# Altium schematic sheet Std 5V.SchDoc
size A4; SheetNumber: 1; SheetTotal: 6
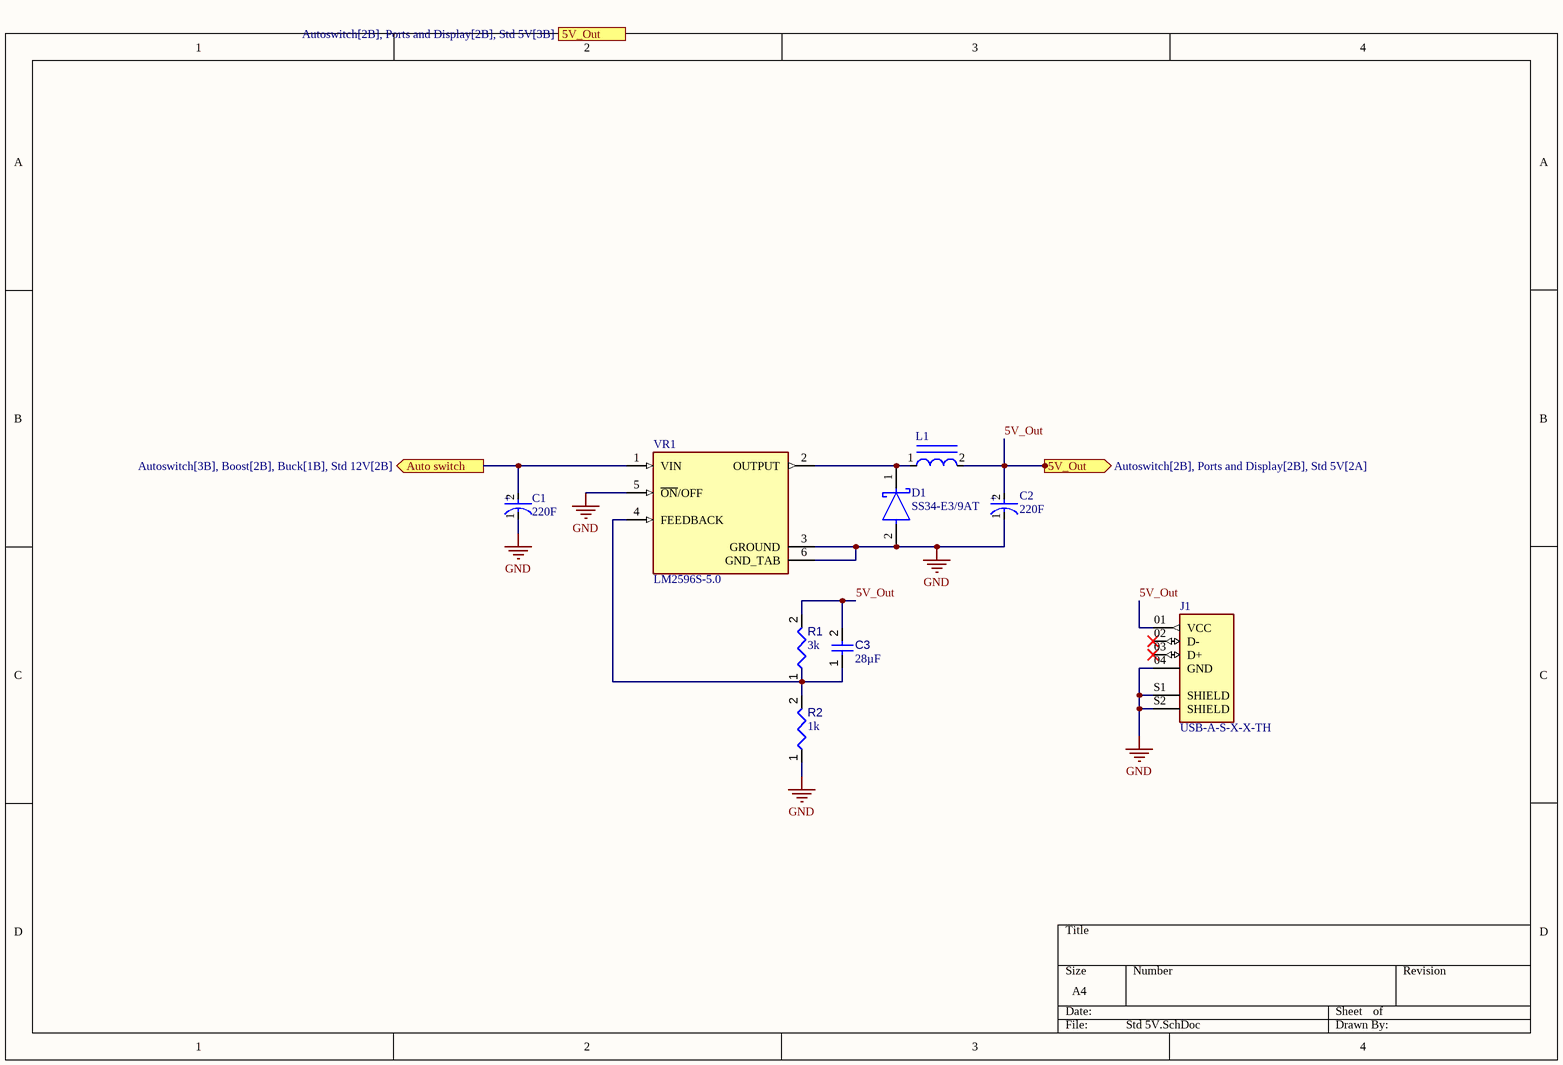
[diagram p0: Std 5V.SchDoc]

## Parts
C1  value 220F  [FP-FTF-MFG]  (hidden comment: Capacitors)
C2  value 220F  [FP-FTF-MFG]  (hidden comment: Capacitors)
C3  value 28µF  [CAPC0805(2012)145_L]  (hidden comment: Capacitor 47µF +/-40% 6.3V 0805)
D1  SS34-E3/9AT  [FP-SMC-MFG]
J1  USB-A-S-X-X-TH  [SAMTEC_USB-A-S-X-X-TH]
L1  DR127-330-R  [FP-DR127-MFG]  (value not drawn)
R1  value 3k  [RESC0805(2012)_L]  (hidden comment: 1KR5J)
R2  value 1k  [RESC0805(2012)_L]  (hidden comment: 1KR5J)
VR1  LM2596S-5.0  [TO170P1524X483-6N]

## Ports
5V_Out (out, see Autoswitch[2B], Ports and Display[2B], Std 5V[2A]), 5V_Out (out, see Autoswitch[2B], Ports and Display[2B], Std 5V[3B]), Auto switch (out, see Autoswitch[3B], Boost[2B], Buck[1B], Std 12V[2B])

## Nets
GND: C1.1(C) C2.1(C) D1.2(A) J1.04(GND) J1.S1(SHIELD) J1.S2(SHIELD) R2.1 VR1.3(GROUND) VR1.5(~{ON}/OFF) VR1.6(GND_TAB)
5V_Out: C2.2(A) C3.2 J1.01(VCC) L1.2 R1.2 ; port 5V_Out
Auto switch: C1.2(A) VR1.1(VIN) ; port Auto switch
NetC3_1: C3.1 R1.1 R2.2 VR1.4(FEEDBACK)
NetD1_1: D1.1(C) L1.1 VR1.2(OUTPUT)

Not connected (* = marked no-connect by the designer): J1 02(D-)* 03(D+)*

## Notes on the sheet
- (in symbol CMP-001-00083-1) +

## Library data of the parts
C1 C2 = CMP-001-00083-1: Aluminum Electrolytic Capacitor, Polarized, Aluminum (wet), 50V, 20% +Tol, 20% -Tol, 220uF, Surface Mount, 3333; Dielectric Material: Aluminium; Ripple Current: 435.5mA; Tan Delta: 0.1; ESR (Equivalent Series Resistance): 180mR; Reference Standard: AEC-Q200; Leakage Current: 110uA; RoHS Compliant: Yes; Tolerance (fill in as +-): 20%; Length: 10.2mm; Rated DC Voltage (URdc): 50V; Min Operating Temperature: -55°C; Packaging: Tape and Reel; Max Operating Temperature: 105°C; Case/Package: 3333; Tolerance  (fill in as +-): 20%; Capacitor Type: Aluminium; Termination: Flat; Reach SVHC Compliant: Yes; Pins: 2; Polarity: Polarized; Package Style: SMTMeter; Mounting Technology: Surface Mount; Diameter: 8mm
C3 = CMP-001-00082-4: Chip Capacitor, 47µF +/-40%, 6.3V, 0805, Thickness 1.45 mm; Tolerance: 10%; Min Operating Temperature: -55°C; Max Operating Temperature: 85°C; Case/Package: 0805; Pins: 2; Mounting Technology: SMT; Voltage Rating: 6.3V
D1 = CMP-004-00032-1: Rectifier Diode, Schottky, 1 Phase, 1 Element, 3A, 40V V(RRM), Silicon, DO-214AB; Max Reverse Current: 500uA; Time @ Peak Reflow Temperature-Max (s): 40s; Case Connection: CATHODE; Qualification Status: Not Qualified; Non-rep Pk Forward Current-Max: 100A; Number of Phases: 1; Package Body Material: Plastic; Application(s): EFFICIENCY; Forward Voltage: 500mV; Diode Type: RECTIFIER; Max Output current: 3A; Peak Reflow Temperature (Cel): 260°C; Package Shape: Rectangular; Terminal Position: DUAL; Terminal Finish: Tin; Min Operating Temperature: -55°C; Max Operating Temperature: 150°C; Diode Element Material: SILICON; Package Style: SMALL OUTLINEMeter; Technology: SCHOTTKY; Number of Elements: 1; Moisture Sensitivity Level: 1; Surface Mount: Yes; JESD-30 Code: R-PDSO-C2; RoHS Compliant: Yes; Rep Pk Reverse Voltage-Max: 40V; Terminal Form: C BEND; Pins: 2; JESD-609 Code: e3; JEDEC-95 Code: DO-214AB; Reach SVHC Compliant: No
J1 = CMP-035-000000-2: USB Connectors USB 2.0 Interface, Type A; MF: Samtec; MP: USB-A-S-F-B-TH-TR; Check_prices: https://www.snapeda.com/parts/USB-A-S-F-B-TH-TR/Samtec/view-part/?ref=eda; Purchase-URL: https://pricing.snapeda.com/search/part/USB-A-S-F-B-TH-TR/?ref=eda; SnapEDA_Link: https://www.snapeda.com/parts/USB-A-S-F-B-TH-TR/Samtec/view-part/?ref=snap; Design Item ID: USB-A-S-X-X-TH; Value: *; Component Type: Standard; Package: None; Source: USB-A-S-X-X-TH.SchLib; Availability: In Stock; Price: None; Pin Count: 6
L1 = CMP-006-00021-1: General Purpose Inductor, 33uH, 20%, 1 Element, Ferrite-Core, SMD, 4949; Package Width: 12.5mm; Case/Size Code: 4949; Shape/Size Description: RECTANGULAR PACKAGE; Inductor Application: DC-DC CONVERTER; Channels: 1; Test Frequency: 100kHz; Package Height: 8mm; Shielding: Shielded; Max Current Rating: 3.23A; DC Resistance (DCR): 60mR; Reach SVHC Compliant: Yes; Surface Mount: Yes; Max Operating Temperature: 125°C; Terminal Placement: Dual Ended; JESD-609 Code: e3; Package Style: SMTMeter; Inductance-Nom (L): 33uH; Package Length: 12.5mm; Tolerance: 20%; RoHS Compliant: Yes; Termination: One Surface; Inductor Type: GENERAL PURPOSE INDUCTOR; Pins: 2; Core Material: Ferrite; Terminal Finish: Nickel; Min Operating Temperature: -40°C; Packaging: Tape and Reel; Construction: Magnetic Shielded
R1 R2 = CMP-009-00076-2: 1K 0.125W 5% 0805 (2012 Metric)  SMD; Power: 125mW; Pins: 2; Mounting Technology: SMT; Tolerance: 5%; Case/Package: 0805
VR1 = CMP-003-000000-1: SIMPLE SWITCHER&reg; 4.5V to 40V, 3A Low Component Count Step-Down Regulator; MF: Texas Instruments; MP: LM2596S-5.0/NOPB; Source: LM2596S-5.0.SchLib; Component Type: Standard; Package: TO-263-5 Texas Instruments; Check_prices: https://www.snapeda.com/parts/LM2596S-5.0/NOPB/Texas+Instruments/view-part/?ref=eda; Value: *; Availability: In Stock; SnapEDA_Link: https://www.snapeda.com/parts/LM2596S-5.0/NOPB/Texas+Instruments/view-part/?ref=snap; Design Item ID: LM2596S-5.0; Pin Count: 6; Purchase-URL: https://pricing.snapeda.com/search/part/LM2596S-5.0/NOPB/?ref=eda; Price: None